# EAGLE design bladdnschbiela (EAGLE 7.5.0)
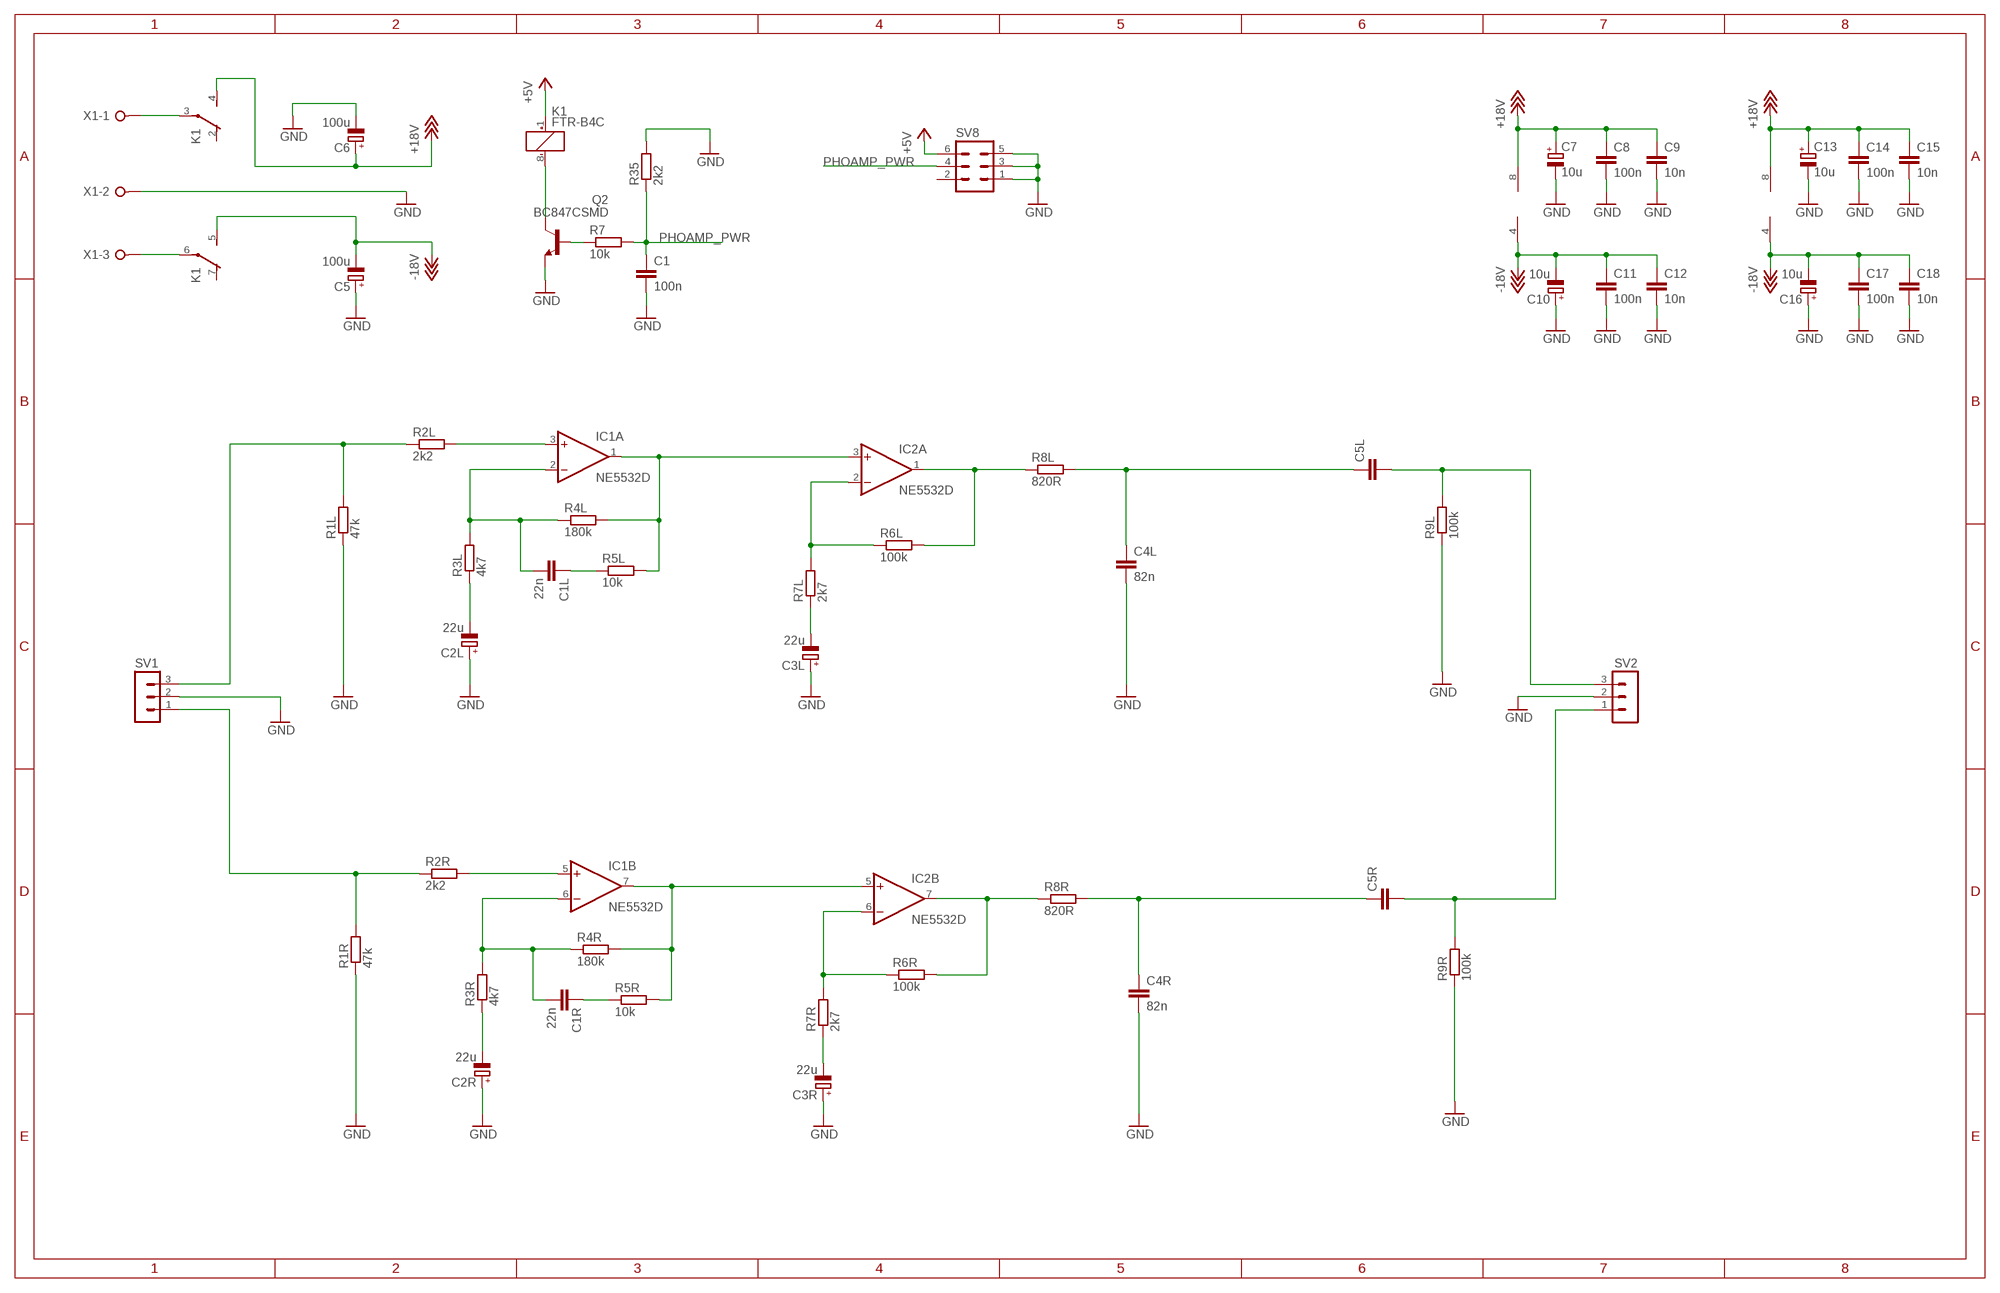
[diagram p0: schematic, sheet 1]

## Parts
C1  100n  C-EUC0603  [C0603]
C1L  22n  C-EUC1206  [C1206]
C1R  22n  C-EUC1206  [C1206]
C2L  22u  CPOL-EU153CLV-0405  [153CLV-0405]
C2R  22u  CPOL-EU153CLV-0405  [153CLV-0405]
C3L  22u  CPOL-EU153CLV-0405  [153CLV-0405]
C3R  22u  CPOL-EU153CLV-0405  [153CLV-0405]
C4L  82n  C-EUC1210  [C1210]
C4R  82n  C-EUC1210  [C1210]
C5  100u  CPOL-EU153CLV-0605  [153CLV-0605]
C5L  C5/7.2/11  [C5B7.2_11]
C5R  C5/7.2/11  [C5B7.2_11]
C6  100u  CPOL-EU153CLV-0605  [153CLV-0605]
C7  10u  CPOL-EU153CLV-0405  [153CLV-0405]
C8  100n  C-EUC0805  [C0805]
C9  10n  C-EUC0805  [C0805]
C10  10u  CPOL-EU153CLV-0405  [153CLV-0405]
C11  100n  C-EUC0805  [C0805]
C12  10n  C-EUC0805  [C0805]
C13  10u  CPOL-EU153CLV-0405  [153CLV-0405]
C14  100n  C-EUC0805  [C0805]
C15  10n  C-EUC0805  [C0805]
C16  10u  CPOL-EU153CLV-0405  [153CLV-0405]
C17  100n  C-EUC0805  [C0805]
C18  10n  C-EUC0805  [C0805]
IC1  NE5532D  [SO08]
IC2  NE5532D  [SO08]
K1  FTR-B4C  [FTR-B4C]
Q2  BC847CSMD  [SOT23]
R1L  47k  R-EU_R0603  [R0603]
R1R  47k  R-EU_R0603  [R0603]
R2L  2k2  R-EU_R0603  [R0603]
R2R  2k2  R-EU_R0603  [R0603]
R3L  4k7  R-EU_R0603  [R0603]
R3R  4k7  R-EU_R0603  [R0603]
R4L  180k  R-EU_R0603  [R0603]
R4R  180k  R-EU_R0603  [R0603]
R5L  10k  R-EU_R0603  [R0603]
R5R  10k  R-EU_R0603  [R0603]
R6L  100k  R-EU_R0603  [R0603]
R6R  100k  R-EU_R0603  [R0603]
R7  10k  R-EU_R0603  [R0603]
R7L  2k7  R-EU_R0603  [R0603]
R7R  2k7  R-EU_R0603  [R0603]
R8L  820R  R-EU_R0603  [R0603]
R8R  820R  R-EU_R0603  [R0603]
R9L  100k  R-EU_R0603  [R0603]
R9R  100k  R-EU_R0603  [R0603]
R35  2k2  R-EU_R0603  [R0603]
SV1  MA03-1  [MA03-1]
SV2  MA03-1  [MA03-1]
SV8  MA03-2B  [MA03-2_BORDER]
X1  W237-3E  [W237-3E]

## Nets
+5V: K1.1(K:+) SV8.6
+18V: C6.+ C7.+ C8.1 C9.1 C13.+ C14.1 C15.1 IC1.8(P:V+) IC2.8(P:V+) K1.4(-1:S)
-18V: C5.- C10.- C11.1 C12.1 C16.- C17.1 C18.1 IC1.4(P:V-) IC2.4(P:V-) K1.5(-2:S)
GND: C1.2 C2L.+ C2R.+ C3L.+ C3R.+ C4L.2 C4R.2 C5.+ C6.- C7.- C8.2 C9.2 C10.+ C11.2 C12.2 C13.- C14.2 C15.2 C16.+ C17.2 C18.2 Q2.2(E) R1L.1 R1R.1 R9L.1 R9R.1 R35.2 SV1.2 SV2.2 SV8.1 SV8.3 SV8.5 X1.2
N$1: IC1.3(A:+IN) R2L.2
N$2: C1L.2 IC1.2(A:-IN) R3L.2 R4L.1
N$3: R1L.2 R2L.1 SV1.3
N$4: C1L.1 R5L.1
N$5: IC1.1(A:OUT) IC2.3(A:+IN) R4L.2 R5L.2
N$6: IC2.2(A:-IN) R6L.1 R7L.2
N$7: C5L.2 R9L.2 SV2.3
N$8: IC2.1(A:OUT) R6L.2 R8L.1
N$9: IC1.5(B:+IN) R2R.2
N$10: C4L.1 C5L.1 R8L.2
N$11: C2L.- R3L.1
N$12: C3L.- R7L.1
N$13: C1R.2 IC1.6(B:-IN) R3R.2 R4R.1
N$14: R1R.2 R2R.1 SV1.1
N$15: IC1.7(B:OUT) IC2.5(B:+IN) R4R.2 R5R.2
N$16: IC2.6(B:-IN) R6R.1 R7R.2
N$17: IC2.7(B:OUT) R6R.2 R8R.1
N$18: C4R.1 C5R.1 R8R.2
N$19: C2R.- R3R.1
N$20: C3R.- R7R.1
N$21: C1R.1 R5R.1
N$22: C5R.2 R9R.2 SV2.1
N$23: K1.3(-1:P) X1.1
N$24: Q2.1(B) R7.1
N$25: K1.6(-2:P) X1.3
N$26: K1.8(K:-) Q2.3(C)
PHOAMP_PWR: C1.1 R7.2 R35.1 SV8.4
Unconnected: K1.2(-1:O) K1.7(-2:O) SV8.2

## Library data of the parts
C1 C1L C1R C4L C4R C8 C9 C11 C12 C14 C15 C17 C18 = rcl:C-EU: CAPACITOR, European symbol
C2L C2R C3L C3R C5-C7 C10 C13 C16 = rcl:CPOL-EU: POLARIZED CAPACITOR, European symbol
C5L C5R = capacitor-wima:C: CAPACITOR naming: grid - package width
IC1 IC2 = linear:NE5532: AUDIO AMPLIFIER
K1 = relay:FTR-B4: ULTRA MINIATURE RELAY 2 POLES - 2 A (Slim Profile Signal Relay) FUJITSU FTR-B4 SERIES Source: FTR-B4.pdf
Q2 = transistor-npn:BC847*: NPN Transistor
R1L R1R R2L R2R R3L R3R R4L R4R R5L R5R R6L R6R R7 R7L R7R R8L R8R R9L R9R R35 = rcl:R-EU_: RESISTOR, European symbol
SV1 SV2 = con-lstb:MA03-1: PIN HEADER; OC_FARNELL: unknown; OC_NEWARK: unknown
SV8 = con-lstb:MA03-2: PIN HEADER
X1 = con-wago-508:W237-3E: WAGO SREW CLAMP; OC_FARNELL: unknown; OC_NEWARK: unknown

## Board
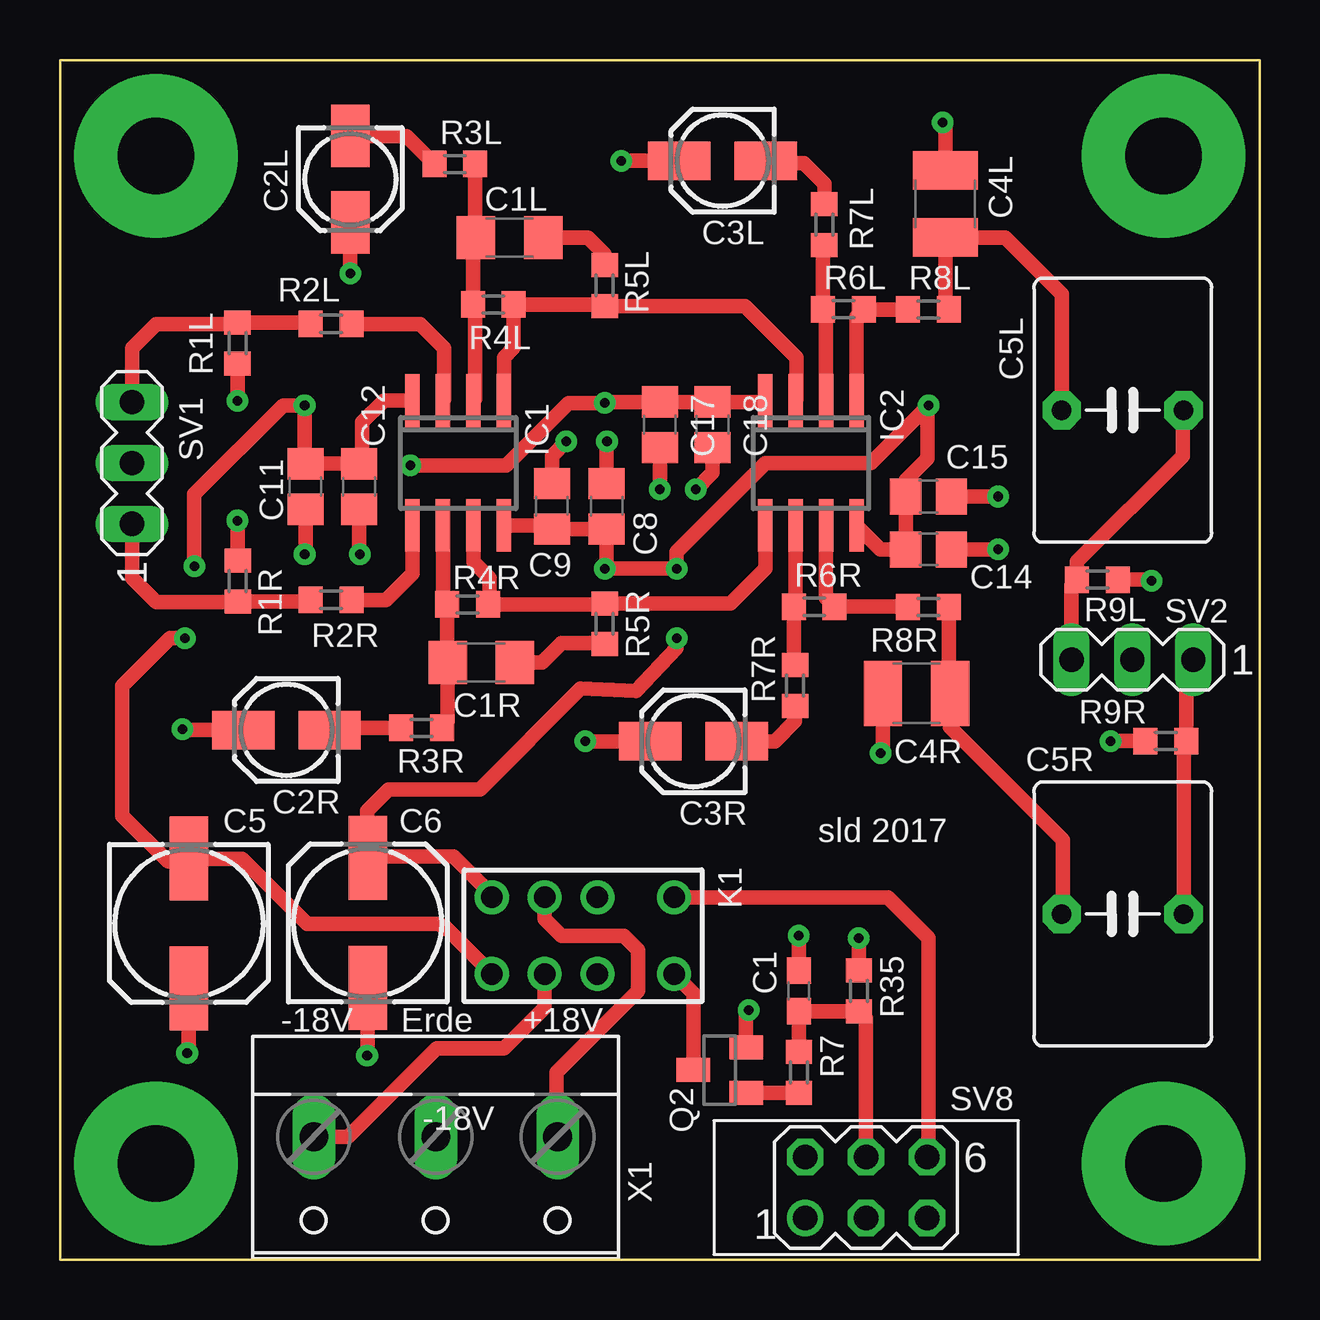
[diagram p1: board, top side]
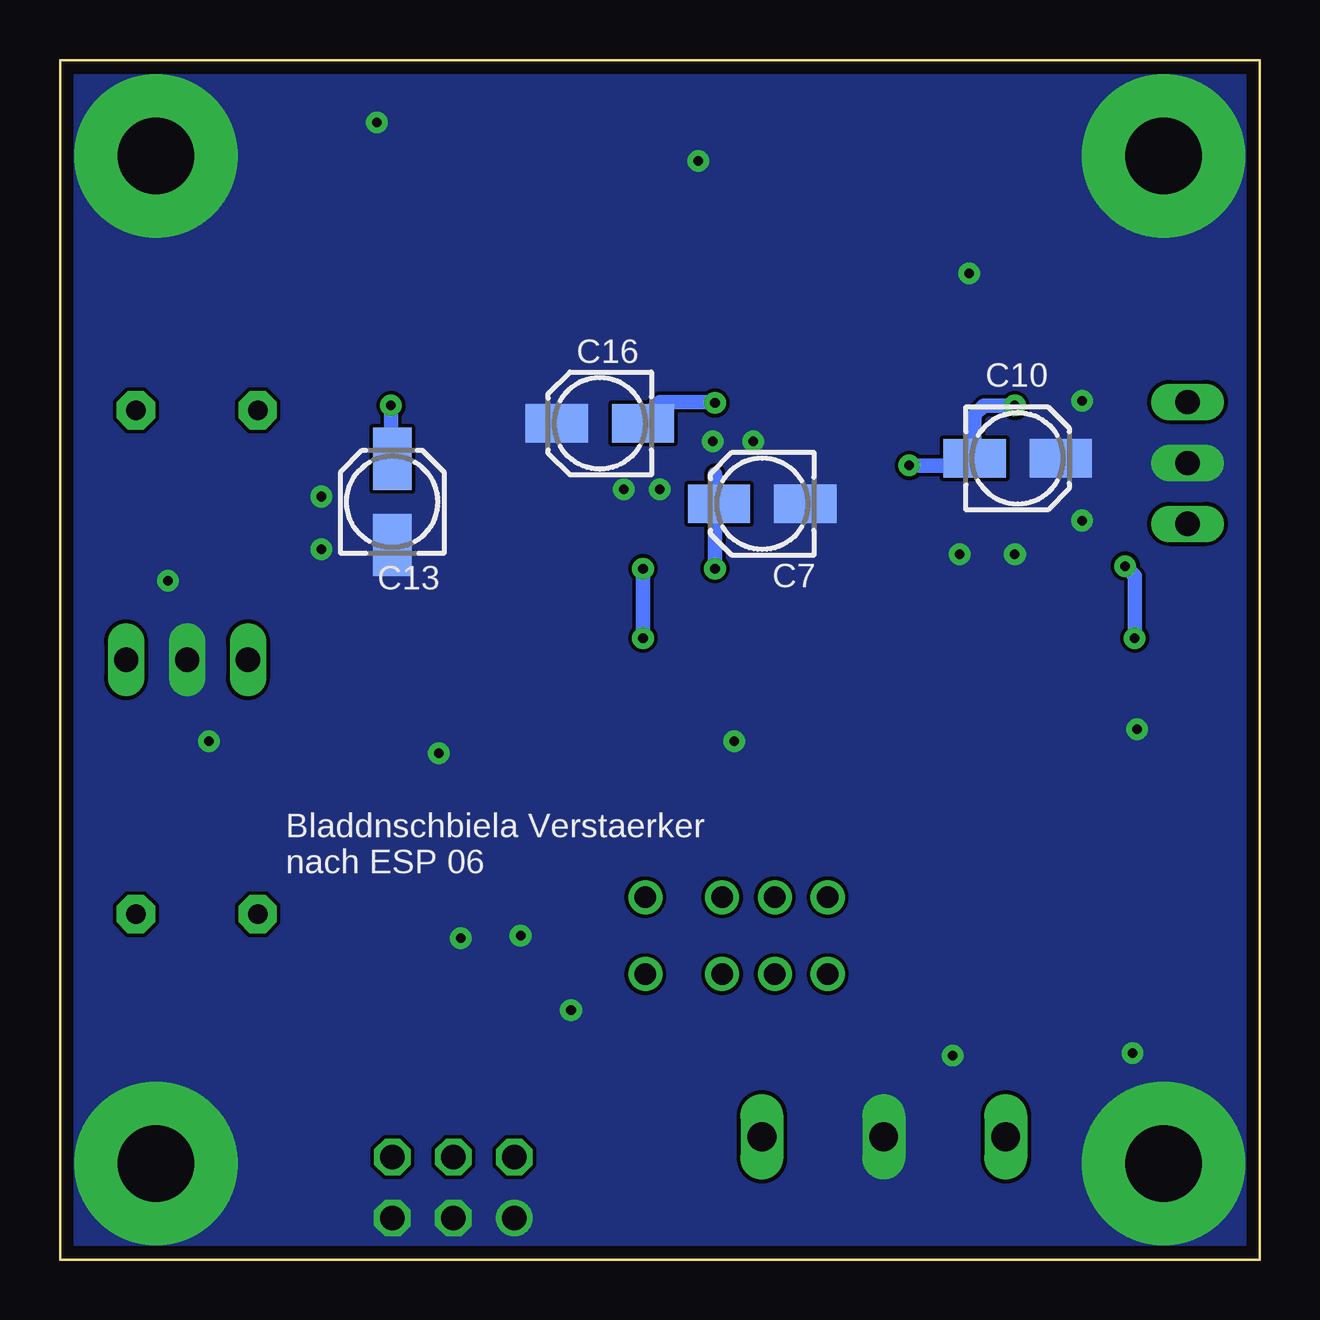
[diagram p2: board, bottom side, seen from below]

Size 50 x 50 mm. Coordinates in mm from the lower left corner, seen from the top.
Outline: 0,0 50,0 50,50 0,50 0,0
Copper layers (1*16): Top 0.035mm / dielectric 1.6mm / Bottom 0.035mm
Design rules "Elecrow_2-layer_PCB_eagle_rule": minimum track width 6mil, minimum drill 12mil, track to track 6mil, track to pad 8mil, pad to pad 12mil, via to via 12mil, smd to smd 0mil, copper to edge 20mil, drill to drill 10mil, minimum pad ring 6mil, minimum via ring 6mil, stop-mask expansion 0mil, vias tented up to drill 100mil, thermal gap 10mil

### Footprints (pad centres in the part's own frame; a part is rotated, then mirrored left to right if it is on the bottom)
C0603 = smd 1.1 x 1: 1 -0.85,0; 2 0.85,0
C1206 = smd 1.6 x 1.8: 1 -1.4,0; 2 1.4,0
153CLV-0405 = smd 2.6 x 1.6: + 1.8,0; - -1.8,0
C1210 = smd 1.6 x 2.7: 1 -1.4,0; 2 1.4,0
153CLV-0605 = smd 3.5 x 1.6: + 2.7,0; - -2.7,0
C5B7.2_11 = drill 0.813 pad 1.6 octagon: 1 -2.54,0; 2 2.54,0
C0805 = smd 1.3 x 1.5: 1 -0.95,0; 2 0.95,0
SO08 = smd 0.6 x 2.2: 1 -1.905,-2.6; 2 -0.635,-2.6; 3 0.635,-2.6; 4 1.905,-2.6; 5 1.905,2.6; 6 0.635,2.6; 7 -0.635,2.6; 8 -1.905,2.6
FTR-B4C = drill 0.9 pad 1.422: 1 -3.8,-1.6; 2 -0.6,-1.6; 3 1.6,-1.6; 4 3.8,-1.6; 5 3.8,1.6; 6 1.6,1.6; 7 -0.6,1.6; 8 -3.8,1.6
SOT23 = smd 1 x 1.4: 1 -0.95,-1.1; 2 0.95,-1.1; 3 0,1.1
R0603 = smd 1 x 1.1: 1 -0.85,0; 2 0.85,0
MA03-1 = drill 1.016 long: 1 -2.54,0; 2 0,0; 3 2.54,0
MA03-2_BORDER = drill 1.016: 1 -2.54,-1.27 | drill 1.016 octagon: 2 -2.54,1.27; 3 0,-1.27; 4 0,1.27; 5 2.54,-1.27; 6 2.54,1.27
W237-3E = drill 1.194 long: 1 -5.08,-0.635; 2 0,-0.635; 3 5.08,-0.635

### Placement (x,y rotation side)
C1  30.8,11.2 90 top
C1L  18.74,42.59 180 top
C1R  17.56,24.89 180 top
C2L  12.1,45.03 270 top
C2R  9.44,22.07 180 top
C3L  27.62,45.8 180 top
C3R  26.4,21.6 180 top
C4L  36.9,44 90 top
C4R  35.7,23.6 180 top
C5  5.37,14.01 270 top
C5L  44.3,35.4 0 top
C5R  44.3,14.4 0 top
C6  12.83,14.03 90 top
C7  20.73,31.5 180 bottom
C8  22.79,31.4 90 top
C9  20.5,31.4 90 top
C10  10.08,33.4 0 bottom
C11  10.23,32.22 270 top
C12  12.47,32.22 270 top
C13  36.15,31.58 90 bottom
C14  36.2,29.6 0 top
C15  36.2,31.8 0 top
C16  27.5,34.85 180 bottom
C17  25,34.8 270 top
C18  27.2,34.8 270 top
IC1  16.6,33.2 180 top
IC2  31.3,33.2 180 top
K1  21.8,13.5 180 top
Q2  27.5,7.9 90 top
R1L  7.4,38.2 90 top
R1R  7.41,28.28 270 top
R2L  11.3,39 0 top
R2R  11.3,27.5 0 top
R3L  16.46,45.66 0 top
R3R  15.07,22.16 0 top
R4L  18.06,39.81 0 top
R4R  16.99,27.31 0 top
R5L  22.7,40.6 270 top
R5R  22.7,26.5 90 top
R6L  32.66,39.61 0 top
R6R  31.44,27.21 0 top
R7  30.8,7.8 90 top
R7L  31.86,43.14 270 top
R7R  30.64,23.93 90 top
R8L  36.2,39.6 0 top
R8R  36.2,27.2 0 top
R9L  43.24,28.34 180 top
R9R  46.09,21.61 0 top
R35  33.3,11.2 90 top
SV1  3,33.2 90 top
SV2  44.7,25 180 top
SV8  33.6,3 0 top
X1  15.66,4.48 180 top

### Tracks (layer width: path | path; a pad name or v marks a point on that pad's centre or on a via)
+5V
  Top 0.6: K1.1 34.5,15.1 36.2,13.4 36.2,4.33 SV8.6
+18V  (via drill 0.4 pad 0.9)
  Top 0.6: K1.4 18,15.2 16.4,16.8 12.9,16.8 C6.+ 12.8,16.76 12.8,18.7 13.7,19.6 17.5,19.6 21.7,23.8 24,23.7 25.7,25.5 v25.7,25.9 | IC1.8 20.35,30.6 C9.1 C8.1 22.79,28.89 v22.7,28.8 v25.7,28.8 25.7,29.5 29.4,33.2 33.8,33.2 v36.2,35.6 36.15,35.55 C13.+ 35.25,32.48 C15.1 C14.1 34.2,29.6 IC2.8
  Bottom 0.6: v22.7,28.8 22.7,32.73 C7.+ | v25.7,28.8 v25.7,25.9 | v36.2,35.6 36.2,33.43 C13.+
-18V  (via drill 0.4 pad 0.9)
  Top 0.6: IC1.4 13.5,35.8 12.6,34.9 12.6,33.3 C12.1 C11.1 10.2,33.2 v10.2,35.6 9.3,35.6 5.6,31.9 v5.6,28.9 | K1.5 16,13.9 15.9,13.9 15.8,14 10.3,14 7.6,16.7 C5.- | C5.- | v14.6,33.1 18.6,33.1 21.2,35.7 v22.7,35.7 22.75,35.75 C17.1 C18.1 29.34,35.75 IC2.4 | C5.- 5.38,17.18 5.5,17.3 5.5,16.7 5.4,16.6 4.5,16.6 2.6,18.5 2.6,23.9 4.6,25.9 v5.2,25.9
  Bottom 0.6: v10.2,35.6 11.5,35.6 11.88,35.22 C10.- 12.18,33.1 v14.6,33.1 | 25.8,34.8 C16.- 25.7,35.05 C17.1 22.75,35.75 v22.7,35.7 | v5.2,25.9 5.2,28.5 v5.6,28.9
GND  (via drill 0.4 pad 0.9, 3.2 pad 6.8)
  Top 0.6: R1L.1 v7.4,35.8 | R1R.1 v7.41,30.79 v7.4,30.8 | C11.2 10.23,29.43 v10.2,29.4 | C12.2 12.47,29.43 v12.5,29.4 | C2L.+ v12.1,41.1 | C17.2 v25,32.1 | C3L.+ v23.4,45.8 | C3R.+ v21.9,21.6 | C2R.+ 5.13,22.07 v5.1,22.1 | Q2.2 28.6,10.3 v28.7,10.4 | C1.2 v30.8,13.5 | C5.+ 5.37,8.67 v5.3,8.6 | C6.- 12.83,8.53 v12.8,8.5 | R35.2 v33.3,13.4 | C4R.2 34.3,21.2 v34.2,21.1 | R9R.1 v43.81,21.61 v43.8,21.6 | R9L.1 45.46,28.34 v45.5,28.3 | C8.2 v22.79,34.09 v22.8,34.1 | C9.2 20.5,33.5 v21.1,34.1 | C18.2 27.2,32.8 v26.5,32.1 | C4L.2 36.9,47.3 v36.8,47.4 | C14.2 v39.1,29.6 | C15.2 v39.1,31.8
  other vias: 4,46 46,46 4,4 46,4
  pour Bottom (no thermals): 0,50 50,50 50,0 0,0
N$1
  Top 0.6: R2L.2 15,39 16,38 16,35.84 IC1.3
N$2
  Top 0.6: R3L.2 17.31,42.62 C1L.2 17.21,42.46 R4L.1 17.21,39.79 17.3,39.7 17.3,35.87 IC1.2
N$3
  Top 0.6: R2L.1 10.4,39.05 R1L.2 7.35,39 4,39 3,38 SV1.3
N$4
  Top 0.6: R5L.1 22.7,41.9 22,42.6 C1L.1
N$5
  Top 0.6: IC1.1 18.5,37.6 18.91,38.01 R4L.2 22.64,39.81 R5L.2 28.55,39.75 30.7,37.6 30.7,35.84 IC2.3
N$6
  Top 0.6: IC2.2 31.93,39.48 R6L.1 31.81,42.24 R7L.2
N$7
  Top 0.6: SV2.3 42.16,28.11 R9L.2 42.39,29.09 46.8,33.5 46.8,35.36 C5L.2
N$8
  Top 0.6: IC2.1 33.2,39.3 R6L.2 R8L.1
N$9
  Top 0.6: R2R.2 13.6,27.5 14.7,28.6 IC1.5
N$10
  Top 0.6: C5L.1 41.76,40.24 39.4,42.6 C4L.1 36.9,39.75 R8L.2
N$11
  Top 0.6: C2L.- 14.44,46.83 R3L.1
N$12
  Top 0.6: R7L.1 31.86,44.84 31,45.7 29.52,45.7 C3L.-
N$13
  Top 0.6: IC1.6 15.96,27.48 R4R.1 16.14,24.91 C1R.2 16.16,22.4 R3R.2
N$14
  Top 0.6: R2R.1 10.41,27.43 R1R.2 7.38,27.4 4,27.4 3,28.4 SV1.1
N$15
  Top 0.6: IC1.7 17.23,29.07 17.9,28.4 17.9,27.37 R4R.2 22.66,27.31 R5R.2 27.95,27.35 29.4,28.8 IC2.5
N$16
  Top 0.6: IC2.6 30.66,27.29 R6R.1 30.59,24.83 R7R.2
N$17
  Top 0.6: R8R.1 R6R.2 31.93,27.57 IC2.7
N$18
  Top 0.6: R8R.2 37.05,23.65 C4R.1 37.1,22.2 41.8,17.5 41.8,14.44 C5R.1
N$19
  Top 0.6: R3R.1 11.33,22.16 C2R.-
N$20
  Top 0.6: R7R.1 30.64,22.44 29.8,21.6 C3R.- 27.6,21.6
N$21
  Top 0.6: C1R.1 20.09,24.89 20.9,25.7 22.65,25.7 R5R.1
N$22
  Top 0.6: C5R.2 46.84,21.51 R9R.2 46.94,24.7 SV2.1
N$23
  Top 0.6: K1.3 20.2,14.2 20.9,13.5 23.5,13.5 24.1,12.9 24.1,11.2 20.7,7.8 20.7,5.16 X1.1
N$24
  Top 0.6: Q2.1 R7.1
N$25
  Top 0.6: X1.3 12.02,5.12 15.7,8.8 18.5,8.8 20.2,10.5 K1.6
N$26
  Top 0.6: Q2.3 26.4,11.1 K1.8
PHOAMP_PWR
  Top 0.6: R7.2 C1.1 R35.1 33.6,10.05 SV8.4

### Text on the board
tNames: sld 2017 | -18V | Erde | +18V | -18V
bNames: Bladdnschbiela Verstaerker / nach ESP 06